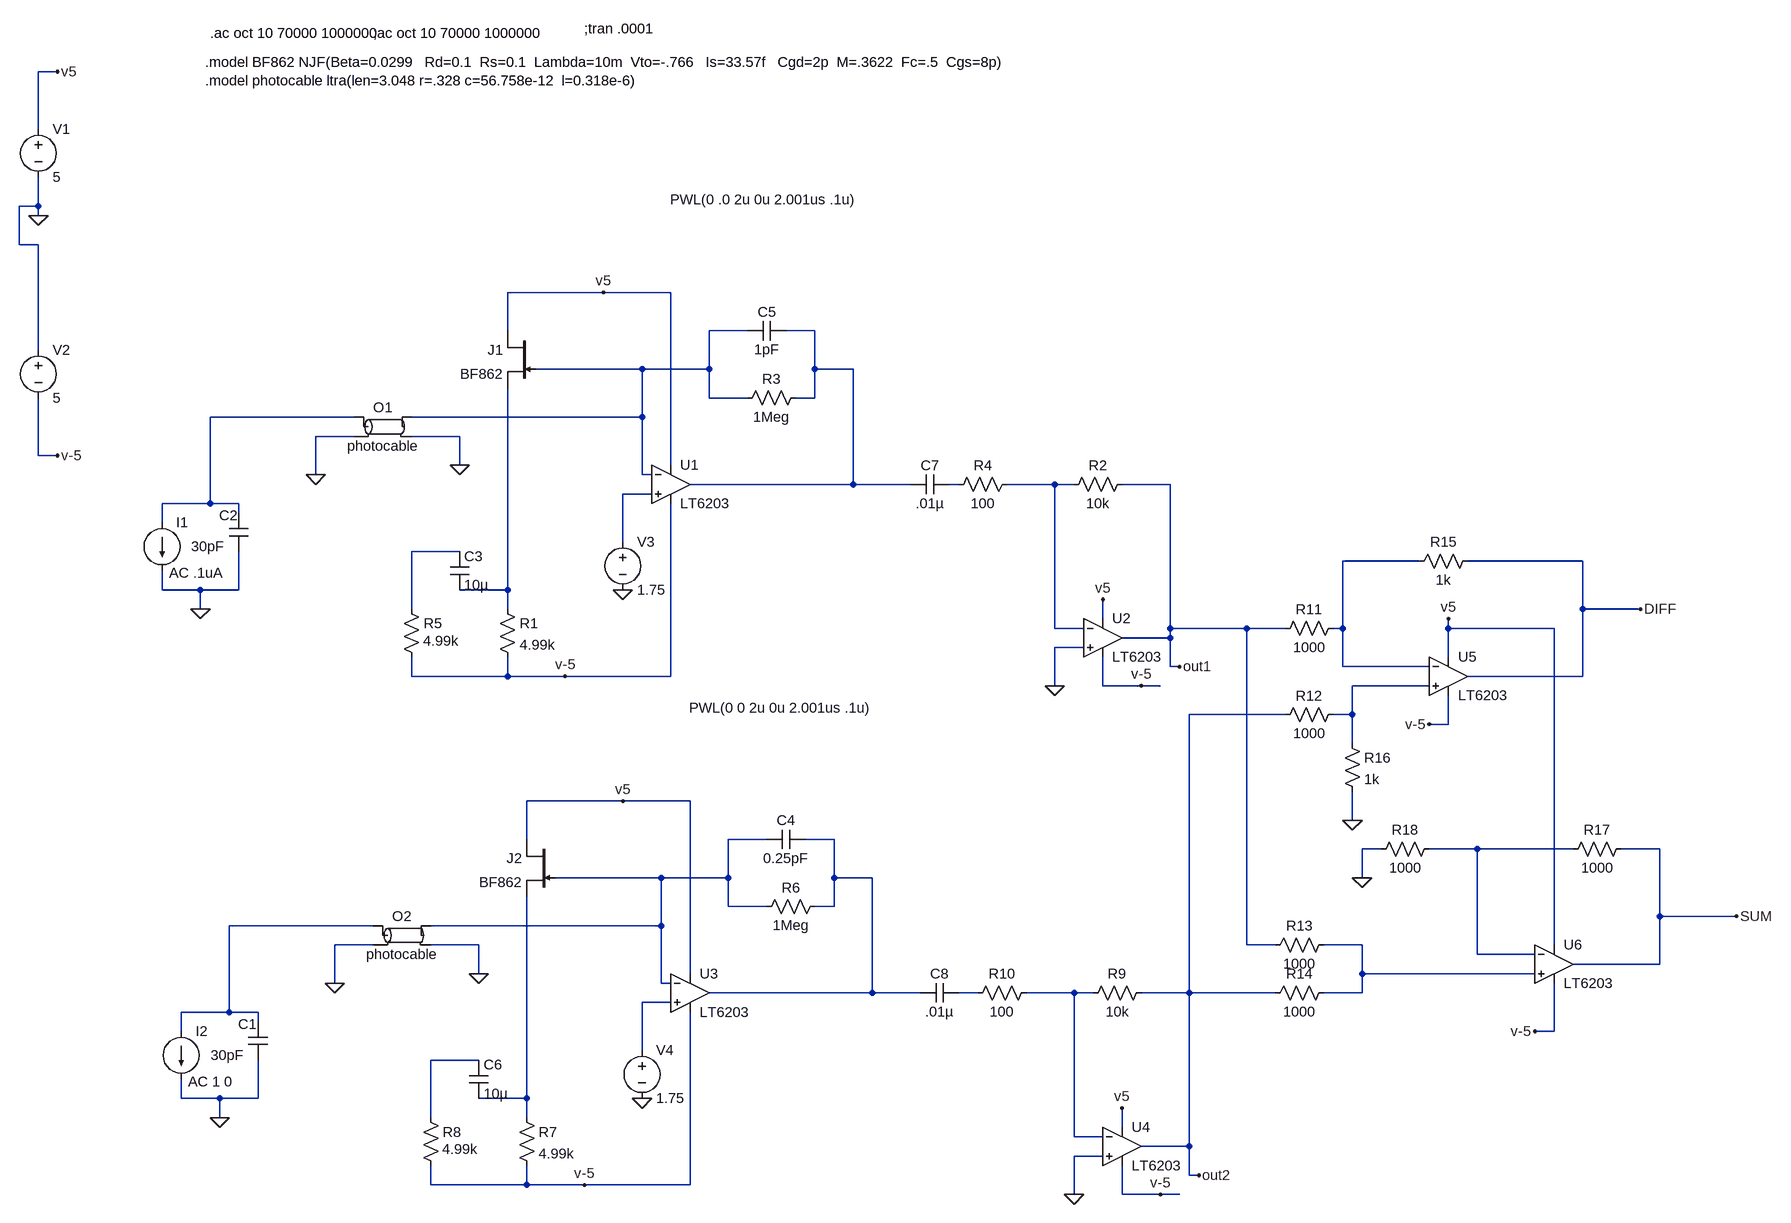
[diagram p0: schematic 6203Complete Frontend w non inv summer pwl 4_13_10.asc]
6203Complete Frontend w non inv summer pwl 4_13_10.asc, the LTspice schematic file:
Version 4
SHEET 1 3232 1580
WIRE -720 -336 -752 -336
WIRE -752 -240 -752 -336
WIRE -752 -112 -752 -160
WIRE -752 -112 -784 -112
WIRE -752 -96 -752 -112
WIRE -784 -48 -784 -112
WIRE -752 -48 -784 -48
WIRE 640 32 480 32
WIRE 752 32 640 32
WIRE 480 96 480 32
WIRE 880 96 816 96
WIRE 992 96 944 96
WIRE -752 128 -752 -48
WIRE 704 160 528 160
WIRE 816 160 816 96
WIRE 816 160 704 160
WIRE 992 160 992 96
WIRE 1056 160 992 160
WIRE 816 208 816 160
WIRE 880 208 816 208
WIRE 992 208 992 160
WIRE 992 208 960 208
WIRE 224 240 -16 240
WIRE 704 240 704 160
WIRE 704 240 320 240
WIRE 224 272 160 272
WIRE 400 272 320 272
WIRE -752 304 -752 208
WIRE -720 304 -752 304
WIRE 400 320 400 272
WIRE 752 320 752 32
WIRE 160 336 160 272
WIRE 704 336 704 240
WIRE 720 336 704 336
WIRE 1056 352 1056 160
WIRE 1056 352 784 352
WIRE 1152 352 1056 352
WIRE 1232 352 1216 352
WIRE 1392 352 1312 352
WIRE 1424 352 1392 352
WIRE 1584 352 1504 352
WIRE 720 368 672 368
WIRE -16 384 -16 240
WIRE -16 384 -96 384
WIRE 32 384 -16 384
WIRE 32 400 32 384
WIRE -96 416 -96 384
WIRE 672 448 672 368
WIRE 400 464 320 464
WIRE 2000 480 1872 480
WIRE 2272 480 2080 480
WIRE -96 528 -96 496
WIRE -32 528 -96 528
WIRE 32 528 32 464
WIRE 32 528 -32 528
WIRE 480 528 480 192
WIRE 480 528 400 528
WIRE -32 560 -32 528
WIRE 320 560 320 464
WIRE 480 560 480 528
WIRE 2272 560 2272 480
WIRE 2368 560 2272 560
WIRE 1472 576 1472 544
WIRE 1392 592 1392 352
WIRE 1440 592 1392 592
WIRE 1584 592 1584 352
WIRE 1712 592 1584 592
WIRE 1776 592 1712 592
WIRE 1872 592 1872 480
WIRE 1872 592 1856 592
WIRE 2048 592 2048 576
WIRE 2224 592 2048 592
WIRE 1584 608 1584 592
WIRE 1584 608 1504 608
WIRE 1440 624 1392 624
WIRE 2048 640 2048 592
WIRE 1584 656 1584 608
WIRE 1600 656 1584 656
WIRE 1872 656 1872 592
WIRE 2016 656 1872 656
WIRE 320 672 320 640
WIRE 480 672 480 640
WIRE 480 672 320 672
WIRE 576 672 480 672
WIRE 752 672 752 384
WIRE 752 672 576 672
WIRE 2272 672 2272 560
WIRE 2272 672 2080 672
WIRE 1392 688 1392 624
WIRE 1472 688 1472 640
WIRE 1536 688 1472 688
WIRE 1568 688 1536 688
WIRE 2016 688 1888 688
WIRE 1776 736 1616 736
WIRE 1888 736 1888 688
WIRE 1888 736 1856 736
WIRE 2048 752 2048 704
WIRE 2048 752 2016 752
WIRE 1888 784 1888 736
WIRE 672 880 512 880
WIRE 784 880 672 880
WIRE 1888 912 1888 864
WIRE 512 944 512 880
WIRE 912 944 848 944
WIRE 1024 944 976 944
WIRE 1936 960 1904 960
WIRE 2096 960 2016 960
WIRE 2256 960 2096 960
WIRE 2400 960 2336 960
WIRE 736 1008 560 1008
WIRE 848 1008 848 944
WIRE 848 1008 736 1008
WIRE 1024 1008 1024 944
WIRE 1088 1008 1024 1008
WIRE 1904 1008 1904 960
WIRE 848 1056 848 1008
WIRE 912 1056 848 1056
WIRE 1024 1056 1024 1008
WIRE 1024 1056 992 1056
WIRE 2400 1072 2400 960
WIRE 2528 1072 2400 1072
WIRE 256 1088 16 1088
WIRE 736 1088 736 1008
WIRE 736 1088 352 1088
WIRE 256 1120 192 1120
WIRE 432 1120 352 1120
WIRE 1712 1120 1712 592
WIRE 1760 1120 1712 1120
WIRE 1904 1120 1840 1120
WIRE 2224 1120 2224 592
WIRE 2096 1136 2096 960
WIRE 2192 1136 2096 1136
WIRE 2400 1152 2400 1072
WIRE 2400 1152 2256 1152
WIRE 432 1168 432 1120
WIRE 784 1168 784 880
WIRE 1904 1168 1904 1120
WIRE 2192 1168 1904 1168
WIRE 192 1184 192 1120
WIRE 736 1184 736 1088
WIRE 752 1184 736 1184
WIRE 1088 1200 1088 1008
WIRE 1088 1200 816 1200
WIRE 1168 1200 1088 1200
WIRE 1264 1200 1232 1200
WIRE 1424 1200 1344 1200
WIRE 1456 1200 1424 1200
WIRE 1616 1200 1616 736
WIRE 1616 1200 1536 1200
WIRE 1760 1200 1616 1200
WIRE 1904 1200 1904 1168
WIRE 1904 1200 1840 1200
WIRE 752 1216 704 1216
WIRE 16 1232 16 1088
WIRE 16 1232 -64 1232
WIRE 64 1232 16 1232
WIRE 64 1248 64 1232
WIRE -64 1264 -64 1232
WIRE 2224 1264 2224 1184
WIRE 2224 1264 2192 1264
WIRE 704 1296 704 1216
WIRE 432 1312 352 1312
WIRE -64 1376 -64 1344
WIRE 0 1376 -64 1376
WIRE 64 1376 64 1312
WIRE 64 1376 0 1376
WIRE 512 1376 512 1040
WIRE 512 1376 432 1376
WIRE 0 1408 0 1376
WIRE 352 1408 352 1312
WIRE 512 1408 512 1376
WIRE 1504 1424 1504 1392
WIRE 1424 1440 1424 1200
WIRE 1472 1440 1424 1440
WIRE 1616 1456 1616 1200
WIRE 1616 1456 1536 1456
WIRE 1472 1472 1424 1472
WIRE 1616 1504 1616 1456
WIRE 1632 1504 1616 1504
WIRE 352 1520 352 1488
WIRE 512 1520 512 1488
WIRE 512 1520 352 1520
WIRE 608 1520 512 1520
WIRE 784 1520 784 1232
WIRE 784 1520 608 1520
WIRE 1424 1536 1424 1472
WIRE 1504 1536 1504 1488
WIRE 1568 1536 1504 1536
WIRE 1600 1536 1568 1536
FLAG -752 -96 0
FLAG 672 528 0
FLAG -720 -336 v5
FLAG -720 304 v-5
FLAG 640 32 v5
FLAG 576 672 v-5
FLAG 160 336 0
FLAG 400 320 0
FLAG -32 560 0
FLAG 704 1376 0
FLAG 1504 1392 v5
FLAG 1632 1504 out2
FLAG 1424 1536 0
FLAG 1568 1536 v-5
FLAG 672 880 v5
FLAG 608 1520 v-5
FLAG 192 1184 0
FLAG 432 1168 0
FLAG 0 1408 0
FLAG 2048 576 v5
FLAG 2016 752 v-5
FLAG 2192 1264 v-5
FLAG 2368 560 DIFF
FLAG 2528 1072 SUM
FLAG 1888 912 0
FLAG 1904 1008 0
FLAG 1472 544 v5
FLAG 1600 656 out1
FLAG 1392 688 0
FLAG 1536 688 v-5
SYMBOL voltage -752 -256 R0
SYMATTR InstName V1
SYMATTR Value 5
SYMBOL current -96 416 R0
WINDOW 3 847 -539 Left 0
WINDOW 123 12 84 Left 0
WINDOW 39 0 0 Left 0
SYMATTR Value PWL(0 .0 2u 0u 2.001us .1u)
SYMATTR Value2 AC .1uA
SYMATTR InstName I1
SYMBOL voltage -752 112 R0
SYMATTR InstName V2
SYMATTR Value 5
SYMBOL cap 16 400 R0
WINDOW 0 -17 4 Left 0
WINDOW 3 -63 56 Left 0
SYMATTR InstName C2
SYMATTR Value 30pF
SYMBOL res 976 192 R90
WINDOW 0 0 56 VBottom 0
WINDOW 3 32 56 VTop 0
SYMATTR InstName R3
SYMATTR Value 1Meg
SYMBOL cap 944 80 R90
WINDOW 0 0 32 VBottom 0
WINDOW 3 32 32 VTop 0
SYMATTR InstName C5
SYMATTR Value 1pF
SYMBOL njf 528 96 M0
SYMATTR InstName J1
SYMATTR Value BF862
SYMBOL res 464 544 R0
SYMATTR InstName R1
SYMATTR Value 4.99k
SYMBOL res 304 544 R0
WINDOW 3 35 69 Left 0
SYMATTR Value 4.99k
SYMATTR InstName R5
SYMBOL Opamps\\LT6203 752 352 R0
SYMATTR InstName U1
SYMBOL voltage 672 432 R0
WINDOW 123 0 0 Left 0
WINDOW 39 0 0 Left 0
SYMATTR InstName V3
SYMATTR Value 1.75
SYMBOL res 1520 336 R90
WINDOW 0 0 56 VBottom 0
WINDOW 3 32 56 VTop 0
SYMATTR InstName R2
SYMATTR Value 10k
SYMATTR SpiceLine tol=1
SYMBOL res 1328 336 R90
WINDOW 0 0 56 VBottom 0
WINDOW 3 32 56 VTop 0
SYMATTR InstName R4
SYMATTR Value 100
SYMATTR SpiceLine tol=1
SYMBOL Opamps\\LT6203 1472 608 R0
SYMATTR InstName U2
SYMBOL cap 384 464 R0
SYMATTR InstName C3
SYMATTR Value 10µ
SYMBOL ltline 272 256 R0
SYMATTR InstName O1
SYMATTR Value photocable
SYMBOL current -64 1264 R0
WINDOW 3 847 -539 Left 0
WINDOW 123 12 84 Left 0
WINDOW 39 0 0 Left 0
SYMATTR Value PWL(0 0 2u 0u 2.001us .1u)
SYMATTR Value2 AC 1 0
SYMATTR InstName I2
SYMBOL cap 48 1248 R0
WINDOW 0 -17 4 Left 0
WINDOW 3 -63 56 Left 0
SYMATTR InstName C1
SYMATTR Value 30pF
SYMBOL res 1008 1040 R90
WINDOW 0 0 56 VBottom 0
WINDOW 3 32 56 VTop 0
SYMATTR InstName R6
SYMATTR Value 1Meg
SYMBOL cap 976 928 R90
WINDOW 0 0 32 VBottom 0
WINDOW 3 32 32 VTop 0
SYMATTR InstName C4
SYMATTR Value 0.25pF
SYMBOL njf 560 944 M0
SYMATTR InstName J2
SYMATTR Value BF862
SYMBOL res 496 1392 R0
SYMATTR InstName R7
SYMATTR Value 4.99k
SYMBOL res 336 1392 R0
WINDOW 3 35 69 Left 0
SYMATTR Value 4.99k
SYMATTR InstName R8
SYMBOL Opamps\\LT6203 784 1200 R0
SYMATTR InstName U3
SYMBOL voltage 704 1280 R0
WINDOW 123 0 0 Left 0
WINDOW 39 0 0 Left 0
SYMATTR InstName V4
SYMATTR Value 1.75
SYMBOL res 1552 1184 R90
WINDOW 0 0 56 VBottom 0
WINDOW 3 32 56 VTop 0
SYMATTR InstName R9
SYMATTR Value 10k
SYMATTR SpiceLine tol=1
SYMBOL res 1360 1184 R90
WINDOW 0 0 56 VBottom 0
WINDOW 3 32 56 VTop 0
SYMATTR InstName R10
SYMATTR Value 100
SYMATTR SpiceLine tol=1
SYMBOL Opamps\\LT6203 1504 1456 R0
SYMATTR InstName U4
SYMBOL cap 416 1312 R0
SYMATTR InstName C6
SYMATTR Value 10µ
SYMBOL ltline 304 1104 R0
SYMATTR InstName O2
SYMATTR Value photocable
SYMBOL Opamps\\LT6203 2048 672 R0
SYMATTR InstName U5
SYMBOL Opamps\\LT6203 2224 1152 R0
SYMATTR InstName U6
SYMBOL res 1872 576 R90
WINDOW 0 0 56 VBottom 0
WINDOW 3 32 56 VTop 0
SYMATTR InstName R11
SYMATTR Value 1000
SYMATTR SpiceLine tol=1
SYMBOL res 1872 720 R90
WINDOW 0 0 56 VBottom 0
WINDOW 3 32 56 VTop 0
SYMATTR InstName R12
SYMATTR Value 1000
SYMATTR SpiceLine tol=1
SYMBOL res 1856 1104 R90
WINDOW 0 0 56 VBottom 0
WINDOW 3 32 56 VTop 0
SYMATTR InstName R13
SYMATTR Value 1000
SYMATTR SpiceLine tol=1
SYMBOL res 1856 1184 R90
WINDOW 0 0 56 VBottom 0
WINDOW 3 32 56 VTop 0
SYMATTR InstName R14
SYMATTR Value 1000
SYMATTR SpiceLine tol=1
SYMBOL res 2096 464 R90
WINDOW 0 0 56 VBottom 0
WINDOW 3 32 56 VTop 0
SYMATTR InstName R15
SYMATTR Value 1k
SYMATTR SpiceLine tol=1
SYMBOL res 1872 768 R0
SYMATTR InstName R16
SYMATTR Value 1k
SYMBOL cap 1216 336 R90
WINDOW 0 0 32 VBottom 0
WINDOW 3 32 32 VTop 0
SYMATTR InstName C7
SYMATTR Value .01µ
SYMBOL cap 1232 1184 R90
WINDOW 0 0 32 VBottom 0
WINDOW 3 32 32 VTop 0
SYMATTR InstName C8
SYMATTR Value .01µ
SYMBOL res 2352 944 R90
WINDOW 0 0 56 VBottom 0
WINDOW 3 32 56 VTop 0
SYMATTR InstName R17
SYMATTR Value 1000
SYMATTR SpiceLine tol=1
SYMBOL res 2032 944 R90
WINDOW 0 0 56 VBottom 0
WINDOW 3 32 56 VTop 0
SYMATTR InstName R18
SYMATTR Value 1000
SYMATTR SpiceLine tol=1
TEXT -24 -352 Left 0 !.model BF862 NJF(Beta=0.0299   Rd=0.1  Rs=0.1  Lambda=10m  Vto=-.766   Is=33.57f   Cgd=2p  M=.3622  Fc=.5  Cgs=8p)\n.model photocable ltra(len=3.048 r=.328 c=56.758e-12  l=0.318e-6)
TEXT -16 -400 Left 0 !.ac oct 10 70000 1000000
TEXT 608 -408 Left 0 !;tran .0001
TEXT 256 -400 Left 0 !;ac oct 10 70000 1000000

The netlist it stands for:
* 6203Complete Frontend w non inv summer pwl 4_13_10.asc
V1 v5 0 5
I1 N003 0 PWL(0 .0 2u 0u 2.001us .1u) AC .1uA
V2 0 v-5 5
C2 N003 0 30pF
R3 N002 N001 1Meg
C5 N002 N001 1pF
J1 v5 N001 N009 BF862
R1 N009 v-5 4.99k
R5 N007 v-5 4.99k
* U1: LT6203 (symbol Opamps\LT6203 not available, pins judged from their places): In+=N006 In-=N001 V+=v5 V-=v-5 OUT=N002
V3 N006 0 1.75
R2 out1 N005 10k tol=1
R4 N005 N004 100 tol=1
* U2: LT6203 (symbol Opamps\LT6203 not available, pins judged from their places): In+=0 In-=N005 V+=v5 V-=v-5 OUT=out1
C3 N007 N009 10µ
O1 N003 0 N001 0 photocable
I2 N014 0 PWL(0 0 2u 0u 2.001us .1u) AC 1 0
C1 N014 0 30pF
R6 N012 N011 1Meg
C4 N012 N011 0.25pF
J2 v5 N011 N020 BF862
R7 N020 v-5 4.99k
R8 N019 v-5 4.99k
* U3: LT6203 (symbol Opamps\LT6203 not available, pins judged from their places): In+=N018 In-=N011 V+=v5 V-=v-5 OUT=N012
V4 N018 0 1.75
R9 out2 N017 10k tol=1
R10 N017 N016 100 tol=1
* U4: LT6203 (symbol Opamps\LT6203 not available, pins judged from their places): In+=0 In-=N017 V+=v5 V-=v-5 OUT=out2
C6 N019 N020 10µ
O2 N014 0 N011 0 photocable
* U5: LT6203 (symbol Opamps\LT6203 not available, pins judged from their places): In+=N010 In-=N008 V+=v5 V-=v-5 OUT=DIFF
* U6: LT6203 (symbol Opamps\LT6203 not available, pins judged from their places): In+=N015 In-=N013 V+=v5 V-=v-5 OUT=SUM
R11 N008 out1 1000 tol=1
R12 N010 out2 1000 tol=1
R13 N015 out1 1000 tol=1
R14 N015 out2 1000 tol=1
R15 DIFF N008 1k tol=1
R16 N010 0 1k
C7 N004 N002 .01µ
C8 N016 N012 .01µ
R17 SUM N013 1000 tol=1
R18 N013 0 1000 tol=1
.model NJF NJF
.model PJF PJF
.lib standard.jft
.model BF862 NJF(Beta=0.0299   Rd=0.1  Rs=0.1  Lambda=10m  Vto=-.766   Is=33.57f   Cgd=2p  M=.3622  Fc=.5  Cgs=8p)
.model photocable ltra(len=3.048 r=.328 c=56.758e-12  l=0.318e-6)
.ac oct 10 70000 1000000
;tran .0001
;ac oct 10 70000 1000000
.backanno
.end